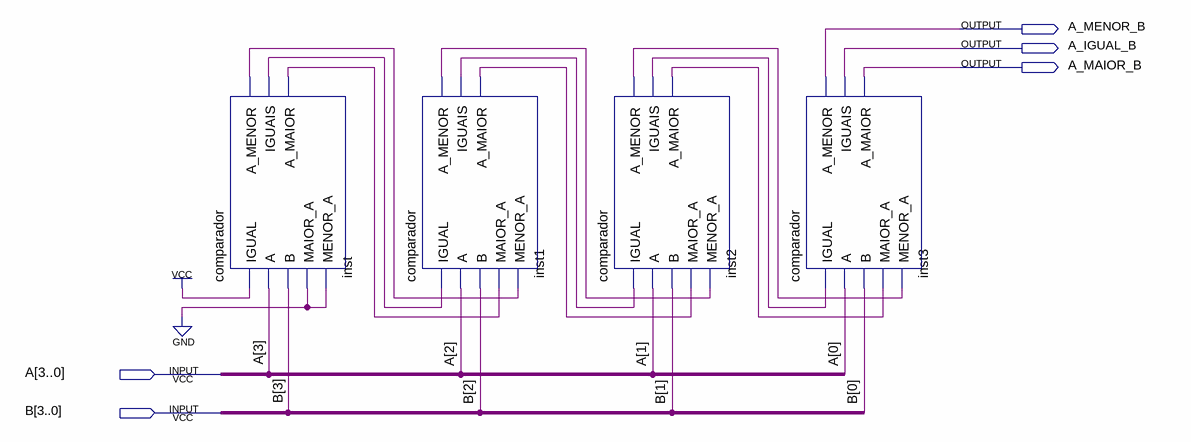
[diagram p0: schematic sheet]
// Quartus schematic comparadorFull.bdf as structural Verilog: 4 symbols, 5 pins
module comparadorFull (
  input  [3:0] A,
  input  [3:0] B,
  output A_MENOR_B,
  output A_IGUAL_B,
  output A_MAIOR_B
);

  wire inst1_a_maior, inst1_a_menor, inst1_iguais, inst2_a_maior, inst2_a_menor, inst2_iguais, inst_a_maior,
       inst_a_menor, inst_iguais;

  comparador inst (
    .IGUAL(1'b1), .A(A[3]), .B(B[3]), .MAIOR_A(1'b0), .MENOR_A(1'b0), .A_MENOR(inst_a_menor),
    .IGUAIS(inst_iguais), .A_MAIOR(inst_a_maior));
  comparador inst1 (
    .IGUAL(inst_iguais), .A(A[2]), .B(B[2]), .MAIOR_A(inst_a_maior), .MENOR_A(inst_a_menor),
    .A_MENOR(inst1_a_menor), .IGUAIS(inst1_iguais), .A_MAIOR(inst1_a_maior));
  comparador inst2 (
    .IGUAL(inst1_iguais), .A(A[1]), .B(B[1]), .MAIOR_A(inst1_a_maior), .MENOR_A(inst1_a_menor),
    .A_MENOR(inst2_a_menor), .IGUAIS(inst2_iguais), .A_MAIOR(inst2_a_maior));
  comparador inst3 (
    .IGUAL(inst2_iguais), .A(A[0]), .B(B[0]), .MAIOR_A(inst2_a_maior), .MENOR_A(inst2_a_menor),
    .A_MENOR(A_MENOR_B), .IGUAIS(A_IGUAL_B), .A_MAIOR(A_MAIOR_B));
endmodule
